# Altium schematic sheet SMA_Banana.SchDoc
size B; Organization: Altium Limited; Address1: L3, 12a Rodborough Rd; Address2: Frenchs Forest; Address3: NSW; Address4: Australia 2086
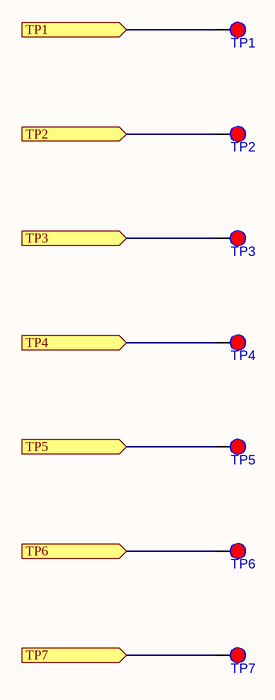
[diagram p0: SMA_Banana.SchDoc]

## Parts
TP1  6.6  [TEST POINT SMALL RED]  (value not drawn)
TP2  6.6  [TEST POINT SMALL RED]  (value not drawn)
TP3  6.6  [TEST POINT SMALL RED]  (value not drawn)
TP4  6.6  [TEST POINT SMALL RED]  (value not drawn)
TP5  6.6  [TEST POINT SMALL RED]  (value not drawn)
TP6  6.6  [TEST POINT SMALL RED]  (value not drawn)
TP7  6.6  [TEST POINT SMALL RED]  (value not drawn)

## Ports
TP1 (in), TP2 (in), TP3 (in), TP4 (in), TP5 (in), TP6 (in), TP7 (in)

## Nets
TP1: TP1.1 ; port TP1
TP2: TP2.1 ; port TP2
TP3: TP3.1 ; port TP3
TP4: TP4.1 ; port TP4
TP5: TP5.1 ; port TP5
TP6: TP6.1 ; port TP6
TP7: TP7.1 ; port TP7

## Notes on the sheet
- Title
- Size:
- Date:
- B
- Number:
- Time:
- Revision:
- Sheet
- of
- File:

## Library data of the parts
TP1-TP7 = TEST POINT SMALL RED: Part_Type: HOLE; Mfr Part Number: 5000; Manufacturer: Keystone; Mfr Part Description: TEST POINT PC MINI .040"D RED; ID: 60203; Updated By: murbach; Value: RED; Supplier 1: Digi-Key; Supplier Part Number 1: 36-5000-ND; RoHS: Yes; Created By: murbach; LifeCycle: New; ComponentLink1Description: Datasheets; ComponentLink1URL: http://www.keyelco.com/product-pdf.cfm?p=1309; ComponentLink2Description: Supplier Part Details; ComponentLink2URL: https://www.digikey.com/products/en/test-and-measurement/test-points/616?k=5000K-ND; Created_Date: 2014/11/24 21:28:44; Updated_Date: 2018/06/14 16:57:12; Sub_Type: Test Point